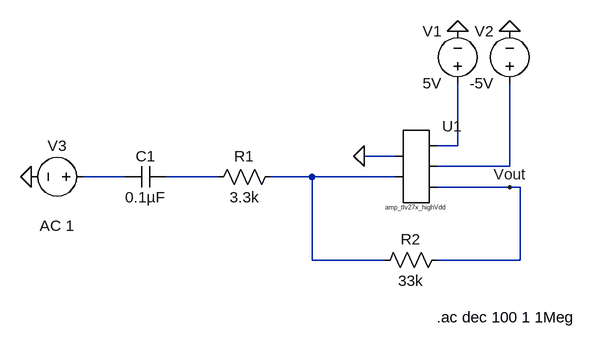
[diagram p0: schematic 9-5-1 Item 5.asc]
9-5-1 Item 5.asc, the LTspice schematic file:
Version 4
SHEET 1 880 680
WIRE 256 128 256 32
WIRE 256 128 224 128
WIRE 160 144 112 144
WIRE 336 160 336 32
WIRE 336 160 224 160
WIRE -256 176 -320 176
WIRE -112 176 -192 176
WIRE 32 176 -32 176
WIRE 160 176 32 176
WIRE 336 192 224 192
WIRE 352 192 336 192
WIRE 32 304 32 176
WIRE 144 304 32 304
WIRE 352 304 352 192
WIRE 352 304 224 304
FLAG 112 144 0
FLAG 336 192 Vout
FLAG 256 -48 0
FLAG 336 -48 0
FLAG -400 176 0
SYMBOL AutoGenerated\\amp_tlv27x_highVdd 192 160 R0
WINDOW 3 0 56 Top 0
SYMATTR InstName U1
SYMBOL voltage 256 48 R180
WINDOW 0 24 96 Left 2
WINDOW 3 24 16 Left 2
SYMATTR InstName V1
SYMATTR Value 5V
SYMBOL voltage 336 48 R180
WINDOW 0 24 96 Left 2
WINDOW 3 24 16 Left 2
SYMATTR InstName V2
SYMATTR Value -5V
SYMBOL res 240 288 R90
WINDOW 0 0 56 VBottom 2
WINDOW 3 32 56 VTop 2
SYMATTR InstName R2
SYMATTR Value 33k
SYMBOL voltage -304 176 R90
WINDOW 0 -32 56 VBottom 2
WINDOW 3 32 56 VTop 2
WINDOW 123 60 56 VTop 2
WINDOW 39 0 0 Left 0
SYMATTR InstName V3
SYMATTR Value ""
SYMATTR Value2 AC 1
SYMBOL res -16 160 R90
WINDOW 0 0 56 VBottom 2
WINDOW 3 32 56 VTop 2
SYMATTR InstName R1
SYMATTR Value 3.3k
SYMBOL cap -192 160 R90
WINDOW 0 0 32 VBottom 2
WINDOW 3 32 32 VTop 2
SYMATTR InstName C1
SYMATTR Value 0.1µF
TEXT 224 392 Left 2 !.ac dec 100 1 1Meg

The netlist it stands for:
* 9-5-1 Item 5.asc
* U1: amp_tlv27x_highVdd (symbol AutoGenerated\amp_tlv27x_highVdd not available, pins judged from their places): pin1=0 pin2=N005 pin3=N001 pin4=N002 pin5=Vout
V1 N001 0 5V
V2 N002 0 -5V
R2 Vout N005 33k
V3 N003 0 AC 1
R1 N005 N004 3.3k
C1 N004 N003 0.1µF
.ac dec 100 1 1Meg
.backanno
.end